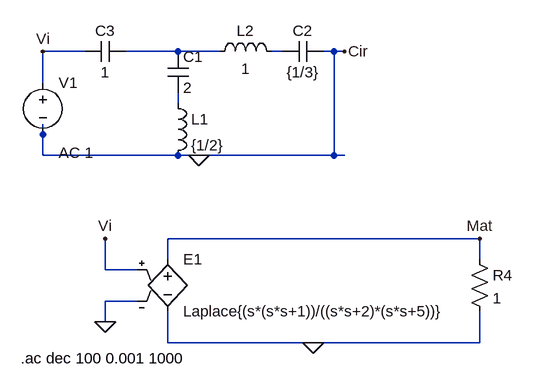
[diagram p0: schematic ej1.asc]
ej1.asc, the LTspice schematic file:
Version 4
SHEET 1 880 680
WIRE -64 112 -128 112
WIRE 80 112 0 112
WIRE 144 112 80 112
WIRE 240 112 224 112
WIRE 320 112 304 112
WIRE 336 112 320 112
WIRE -128 160 -128 112
WIRE 80 192 80 176
WIRE -128 240 -128 224
WIRE -128 272 -128 240
WIRE 80 272 -128 272
WIRE 112 272 80 272
WIRE 320 272 320 112
WIRE 320 272 112 272
WIRE 336 272 320 272
WIRE 544 400 64 400
WIRE 64 432 64 400
WIRE 544 432 544 400
WIRE -32 448 -32 400
WIRE 16 448 -32 448
WIRE 16 496 -32 496
WIRE -32 528 -32 496
WIRE 64 560 64 512
WIRE 288 560 64 560
WIRE 544 560 544 512
WIRE 544 560 288 560
FLAG 112 272 0
FLAG 288 560 0
FLAG -128 112 Vi
FLAG -32 400 Vi
FLAG -32 528 0
FLAG 336 112 Cir
FLAG 544 400 Mat
SYMBOL voltage -128 144 R0
WINDOW 123 24 124 Left 2
WINDOW 39 0 0 Left 0
SYMATTR InstName V1
SYMATTR Value ""
SYMATTR Value2 AC 1
SYMBOL res 528 416 R0
SYMATTR InstName R4
SYMATTR Value 1
SYMBOL e 64 416 R0
SYMATTR InstName E1
SYMATTR Value Laplace{(s*(s*s+1))/((s*s+2)*(s*s+5))}
SYMBOL cap 64 112 R0
SYMATTR InstName C1
SYMATTR Value 2
SYMBOL ind 64 176 R0
SYMATTR InstName L1
SYMATTR Value {1/2}
SYMBOL ind 128 128 R270
WINDOW 0 32 56 VTop 2
WINDOW 3 5 56 VBottom 2
SYMATTR InstName L2
SYMATTR Value 1
SYMBOL cap 304 96 R90
WINDOW 0 0 32 VBottom 2
WINDOW 3 32 32 VTop 2
SYMATTR InstName C2
SYMATTR Value {1/3}
SYMBOL cap 0 96 R90
WINDOW 0 0 32 VBottom 2
WINDOW 3 32 32 VTop 2
SYMATTR InstName C3
SYMATTR Value 1
TEXT -162 584 Left 2 !.ac dec 100 0.001 1000

The netlist it stands for:
* ej1.asc
V1 Vi 0 AC 1
R4 Mat 0 1
E1 Mat 0 Vi 0 Laplace{(s*(s*s+1))/((s*s+2)*(s*s+5))}
C1 N001 N003 2
L1 N003 0 {1/2}
L2 N001 N002 1
C2 0 N002 {1/3}
C3 N001 Vi 1
.ac dec 100 0.001 1000
.backanno
.end